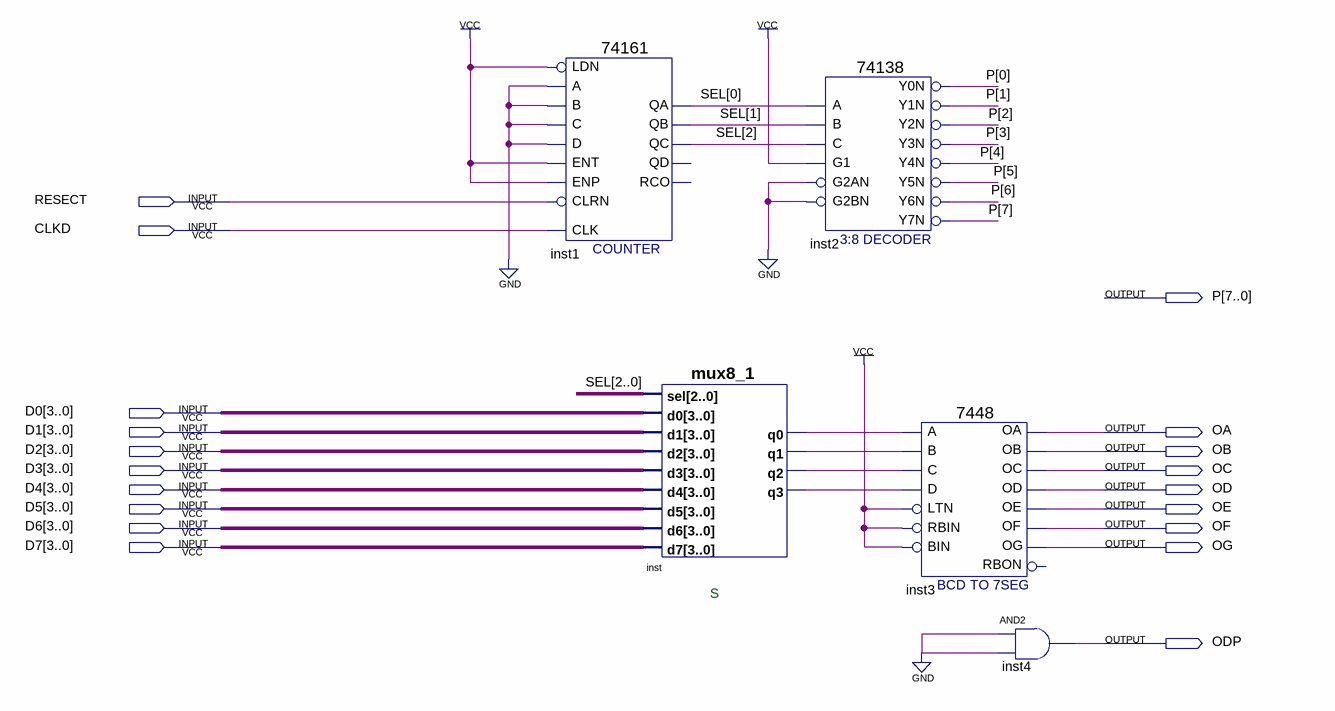
[diagram p0: schematic sheet]
// Quartus schematic ScanOutput.bdf as structural Verilog: 5 symbols, 19 pins
module ScanOutput (
  input  RESECT,
  input  CLKD,
  input  [3:0] D0,
  input  [3:0] D1,
  input  [3:0] D2,
  input  [3:0] D3,
  input  [3:0] D4,
  input  [3:0] D5,
  input  [3:0] D6,
  input  [3:0] D7,
  output [7:0] P,
  output OA,
  output OB,
  output OC,
  output OD,
  output OE,
  output OF,
  output OG,
  output ODP
);

  wire inst_q0, inst_q1, inst_q2, inst_q3;
  wire [2:0] SEL;

  \74161  inst1 (
    .CLRN(RESECT), .CLK(CLKD), .ENP(1'b1), .LDN(1'b1), .A(1'b0), .D(1'b0), .ENT(1'b1), .B(1'b0), .C(1'b0),
    .QC(SEL[2]), .QB(SEL[1]), .QA(SEL[0]));  // open: QD, RCO
  mux8_1 inst (
    .sel(SEL), .d0(D0), .d1(D1), .d2(D2), .d3(D3), .d4(D4), .d5(D5), .d6(D6), .d7(D7), .q0(inst_q0),
    .q1(inst_q1), .q2(inst_q2), .q3(inst_q3));
  \74138  inst2 (
    .A(SEL[0]), .B(SEL[1]), .G1(1'b1), .C(SEL[2]), .G2AN(1'b0), .G2BN(1'b0), .Y0N(P[0]), .Y1N(P[1]),
    .Y2N(P[2]), .Y3N(P[3]), .Y4N(P[4]), .Y5N(P[5]), .Y6N(P[6]), .Y7N(P[7]));
  \7448  inst3 (
    .A(inst_q0), .C(inst_q2), .D(inst_q3), .B(inst_q1), .RBIN(1'b1), .BIN(1'b1), .LTN(1'b1), .OC(OC),
    .OE(OE), .OD(OD), .OF(OF), .OG(OG), .OB(OB), .OA(OA));  // open: RBON
  and inst4 (ODP, 1'b0, 1'b0);

  // Notes on the sheet:
  //   S
endmodule
